# Altium project RFID Access Control System.PrjPcb
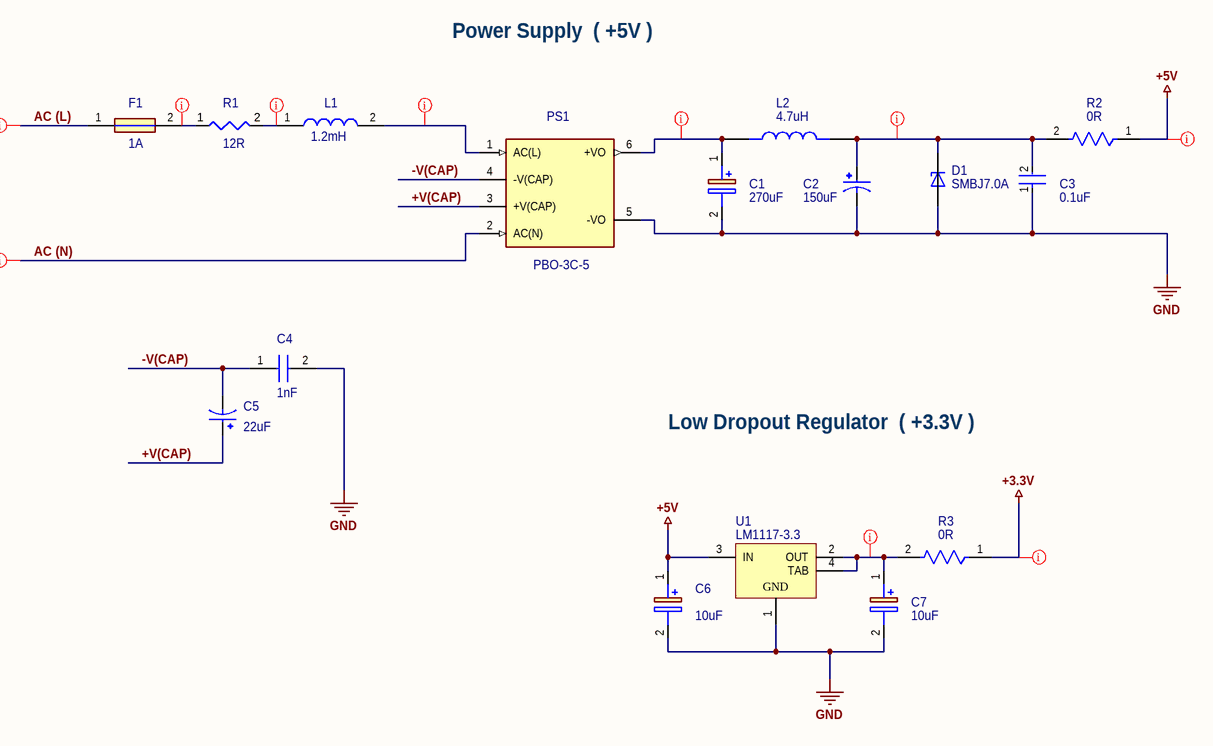
[diagram p0: Power Supply and Regulation.SchDoc]
3 sheets, 43 parts. Net scope: global (net labels, ports and power ports of the same name join across sheets).
Board files: Main.PcbDoc, Main_v2.PcbDoc
Sheets:
  Power Supply and Regulation.SchDoc
  IO and MCU.SchDoc
  External connections.SchDoc

## Sheet Power Supply and Regulation.SchDoc: Power Supply and Regulation Section
size A4; DrawnBy: Avishka C. Herath; DocumentNumber: EN2160 #1; Revision: 1.12; SheetNumber: 1; SheetTotal: 3; Index Number: 200212F; Project: RFID Access Control System

### Parts
C1  270uF  [CAPPRD250W65D630H900]
C2  150uF  [CAPPRD500W60D800H1150]
C3  0.1uF  [FP-CL10-0_1-MFG]
C4  1nF  [B32529C8102J]
C5  22uF  [CAPPRD750W80D1600H2500]
C6  10uF  [T491B]
C7  10uF  [T491B]
D1  SMBJ7.0A  [DIOM4336X265N]
F1  1A  [SS5H1AAPH]
L1  1.2mH  [RLB9012122KL]
L2  4.7uH  [IND_ASPI-0615FS-4R7M-T2]
PS1  PBO-3C-5  [CONV_PBO-3C-5]
R1  12R  [WA84-12RJI-Footprint-1]
R2  0R  [FP-RC0805-MFG]
R3  0R  [FP-RC0805-MFG]
U1  LM1117-3.3  [DCY0004A_L]

### Nets
+3.3V: R3.1
+5V: C6.1(+) R2.1 U1.3(IN)
GND: C1.2(-) C2.N C3.1 C4.2 C6.2(-) C7.2(-) D1.A PS1.5(-VO) U1.1(GND)
+V(CAP): C5.P PS1.3(+V(CAP))
-V(CAP): C4.1 C5.N PS1.4(-V(CAP))
AC (L): F1.1
AC (N): PS1.2(AC(N))
NetC1_1: C1.1(+) L2.1 PS1.6(+VO)
NetC2_P: C2.P C3.2 D1.C L2.2 R2.2
NetC7_1: C7.1(+) R3.2 U1.2(OUT) U1.4(TAB)
NetF1_2: F1.2 R1.1
NetL1_1: L1.1 R1.2
NetL1_2: L1.2 PS1.1(AC(L))

Not connected (* = marked no-connect by the designer): PS1 4_2(-V(CAP)) 5_2(-VO)

### Layout directives
net class V_out: +3.3V, +5V, NetC1_1, NetC2_P, NetC7_1
net class AC: AC (L), AC (N), NetF1_2, NetL1_1, NetL1_2

### Notes on the sheet
- Power Supply  ( +5V )
- Low Dropout Regulator  ( +3.3V )
- Title:
- Size:
- Date:
- A4
- Document Number:
- Sheet
- Revision:
- of
- Project:
- Drawn By:

### Library data of the parts
C1 = 6SEPC560MW+TSS: Aluminum Organic Polymer Capacitors; Manufacturer_Name: KEMET; Manufacturer_Part_Number: A750EM277M1CAAE015; Datasheet Link: http://industrial.panasonic.com/cdbs/www-data/pdf/AAB8000/AAB8000C247.pdf; Height: 9mm; Mouser Part Number: 667-6SEPC560MW+TSS; Mouser Price/Stock: https://www.mouser.co.uk/ProductDetail/Panasonic/6SEPC560MW%2bTSS?qs=OE1iw1LrrPGkg%2Fufb0Bk8Q%3D%3D; Arrow Part Number: 6SEPC560MW+TSS; Arrow Price/Stock: https://www.arrow.com/en/products/6sepc560mwtss/panasonic?region=nac
C2 = EEUFR1V221B: FR-A; MF: {'manufacturer': u'Panasonic'}; MP: UHE1V151MPD1TD; Value: *; Price: None; Availability: Unavailable; Package: None
C3 = CMP-13271-000011-1: CAP CER 0.1UF 50V X7R 0603; Manufacturer: Samsung Electro-Mechanics America, Inc; Manufacturer Part Number: CL10B104JB8NNNC; Value: 100nF; Material: Ceramic; Temperature Coefficient: 15%; Tolerance: 5%; Ipc Land Pattern Name: CAPC16080X80; Device Class L1: Passive Components; Digikey Description: CAP CER 0.1UF 50V X7R 0603; Voltage Rating: 50V; Height: 0.9mm; ComponentLink2Description: Datasheet; Device Class L2: Capacitors; ComponentLink2URL: http://www.samsungsem.com/kr/support/product-search/mlcc/__icsFiles/afieldfile/2019/06/18/CL10B104JB8NNNC-19.pdf; Temperature Characteristic: X7R; Temperature Range High: +125°C; Lead Free: Yes; Temperature Range Low: -55°C; Category: Cap; Package: CL10-0.1; Temperature: -55°C to +125°C; Octopart: https://octopart.com/cl10b104jb8nnnc-samsung-9302151; Device Class L3: Ceramic Capacitors; RoHS: TRUE; Automotive: No; Capacitance: 100nF
C4 = B32529C8102J: Capacitor; Manufacturer_Name: TDK; Datasheet Link: https://componentsearchengine.com/Datasheets/1/B32529C8102J.pdf; Height: 6.5mm; Manufacturer_Part_Number: B32529C8102J; Mouser Part Number: 871-B32529C8102J; Mouser Price/Stock: https://www.mouser.co.uk/ProductDetail/EPCOS-TDK/B32529C8102J?qs=CveI%2FUwZDBKgVtfngCVMDw%3D%3D
C5 = EEUTP1E272B: Aluminum Electrolytic Capacitors - Radial Leaded; MF: Nichicon; MP: UVR2W220MHD; Value: 22uF; Price: None; Availability: Unavailable; Package: Bulk; ComponentLink1Description: Mouser; ComponentLink1URL: https://www.mouser.com/ProductDetail/Nichicon/UVR2W220MHD?qs=%252BlpsHQzXjw%2F%252B5drQqN1W8w%3D%3D; Supplier 1: Rs; Supplier Part Number 1: 5201365
C6 C7 = T491B106M010AT: Capacitor Polarised; Manufacturer_Name: KEMET; Datasheet Link: https://content.kemet.com/datasheets/KEM_T2005_T491.pdf; Height: 2.1mm; Manufacturer_Part_Number: T491B106M010AT; Mouser Part Number: 80-T491B106M010; Arrow Part Number: T491B106M010AT; Arrow Price/Stock: https://www.arrow.com/en/products/t491b106m010at/kemet-corporation?region=nac
D1 = SMBJ7.0A: MF: {'manufacturer': u'Littelfuse'}; Value: *; Price: None; Availability: Unavailable; Package: None; MP: SMBJ7.0A
F1 = CMP-018-000000-1: Fuse; Manufacturer_Name: Eaton; Datasheet Link: https://www.eaton.com/content/dam/eaton/products/electronic-components/resources/data-sheet/eaton-ss-5h-subminiature-radial-leaded-time-delay-fuses-data-sheet.pdf; Height: 8.55mm; Arrow Price/Stock: https://www.arrow.com/en/products/ss-5h-1a-aph/eaton?region=nac; Pin Count: 2; Source: SamacSys.SchLib; Design Item ID: SS-5H-1A-APH; Mouser Part Number: 504-SS-5H-1A-APH; Manufacturer_Part_Number: SS-5H-1A-APH; Arrow Part Number: SS-5H-1A-APH; Component Type: Standard; Mouser Price/Stock: https://www.mouser.co.uk/ProductDetail/Bussmann-Eaton/SS-5H-1A-APH?qs=uEhifBLpbD3ldHjMqFUUYA%3D%3D
L1 = RLB9012-122KL: Inductor; Manufacturer_Name: Bourns; Datasheet Link: https://datasheet.datasheetarchive.com/originals/dk/DKDS-12/225018.pdf; Height: 12.2mm; Manufacturer_Part_Number: RLB9012-122KL; Mouser Part Number: 652-RLB9012-122KL; Mouser Price/Stock: https://www.mouser.co.uk/ProductDetail/Bourns/RLB9012-122KL?qs=dB0LedT%252BmmC%2Fvhpfl8NA4g%3D%3D; Arrow Part Number: RLB9012-122KL; Arrow Price/Stock: https://www.arrow.com/en/products/rlb9012-122kl/bourns?region=nac
L2 = ASPI-0615FS-4R7M-T2: MF: {'manufacturer': u'Abracon'}; Value: *; Price: None; Availability: Unavailable; Package: None; MP: ASPI-0615FS-4R7M-T2
PS1 = PBO-3C-5: MF: {'manufacturer': u'CUI'}; Value: *; Price: None; Availability: Unavailable; Package: None; MP: PBO-3C-5
R1 = CMP-009-00177-4: Through Hole Wirewound Resistor, Wa80 Series, 12 Ohm, 3 W, - 5%, 100 V, Axial Leaded Rohs Compliant: Yes; Body Length: 14.5mm; Lead Length: 24.55mm; Lead Diameter: 0.8mm; Body Diameter: 5.2mm; Case/Package: Axial
R2 R3 = CMP-2001-04570-2: RES SMD 0 OHM JUMPER 1/8W 0805; Manufacturer: Yageo; Manufacturer Part Number: RC0805FR-070RL; Resistance: 0Ω; Value: 0Ω; Power Rating: 0.125W; Tolerance: 1%; Voltage Rating: 150V; RoHS: TRUE; Device Class L2: Resistors; Composition: Thick Film; Device Class L1: Passive Components; Height: 0.6mm; Category: Res; Automotive: No; Device Class L3: Chip SMD Resistors; ComponentLink2URL: http://www.yageo.com/documents/recent/PYu-RC_Group_51_RoHS_L_10.pdf; Octopart: https://octopart.com/rc0805fr-070rl-yageo-9293404; Temperature Range High: +155°C; Ipc Land Pattern Name: RESC200125X50; Footprint Url: http://www.yageo.com/exep/pages/download/literatures/PYu-R_Mount_10.pdf; Series: RC_L; Digikey Description: RES SMD 0 OHM JUMPER 1/8W 0805; Temperature Range Low: -55°C; Temperature: -55°C to +155°C; Package: RC0805; ComponentLink2Description: Datasheet; Lead Free: Yes
U1 = CMP-0062-01639-4: 800mA Low-Dropout Linear Regulator, 4-pin SOT-223, Pb-Free; PartNumber: LM1117MPX-3.3/NOPB; Manufacturer: Texas Instruments; High-Reliability: Y; PowerWise: N; PackageTopMarking: XYTT*N05A; CompType: LDO IC; ComponentLink1URL: http://www.ti.com/general/docs/lit/getliterature.tsp?genericPartNumber=LM1117-N&fileType=pdf; ComponentLink1Description: Datasheet URL; PinCount: 4; Code_JEDEC: TO-261-AA; PackageDescription: Molded SOT-223, 6.50 x 3.56 x 1.6mm Body, 4 Lead, 2.3mm Pitch; PackageReference: DCY0004A; RoHS: Y; Code_IPC: SOT223-4

## Sheet IO and MCU.SchDoc: IO and MCU Section
size A4; DrawnBy: Avishka C. Herath; DocumentNumber: EN2160 #2; Revision: 1.12; SheetNumber: 2; SheetTotal: 3; Index Number: 200212F; Project: RFID Access Control System; ENG_APP_DATE: --/--/--; DSN_APP_DATE: --/--/--; CHK_APP_DATE: --/--/--
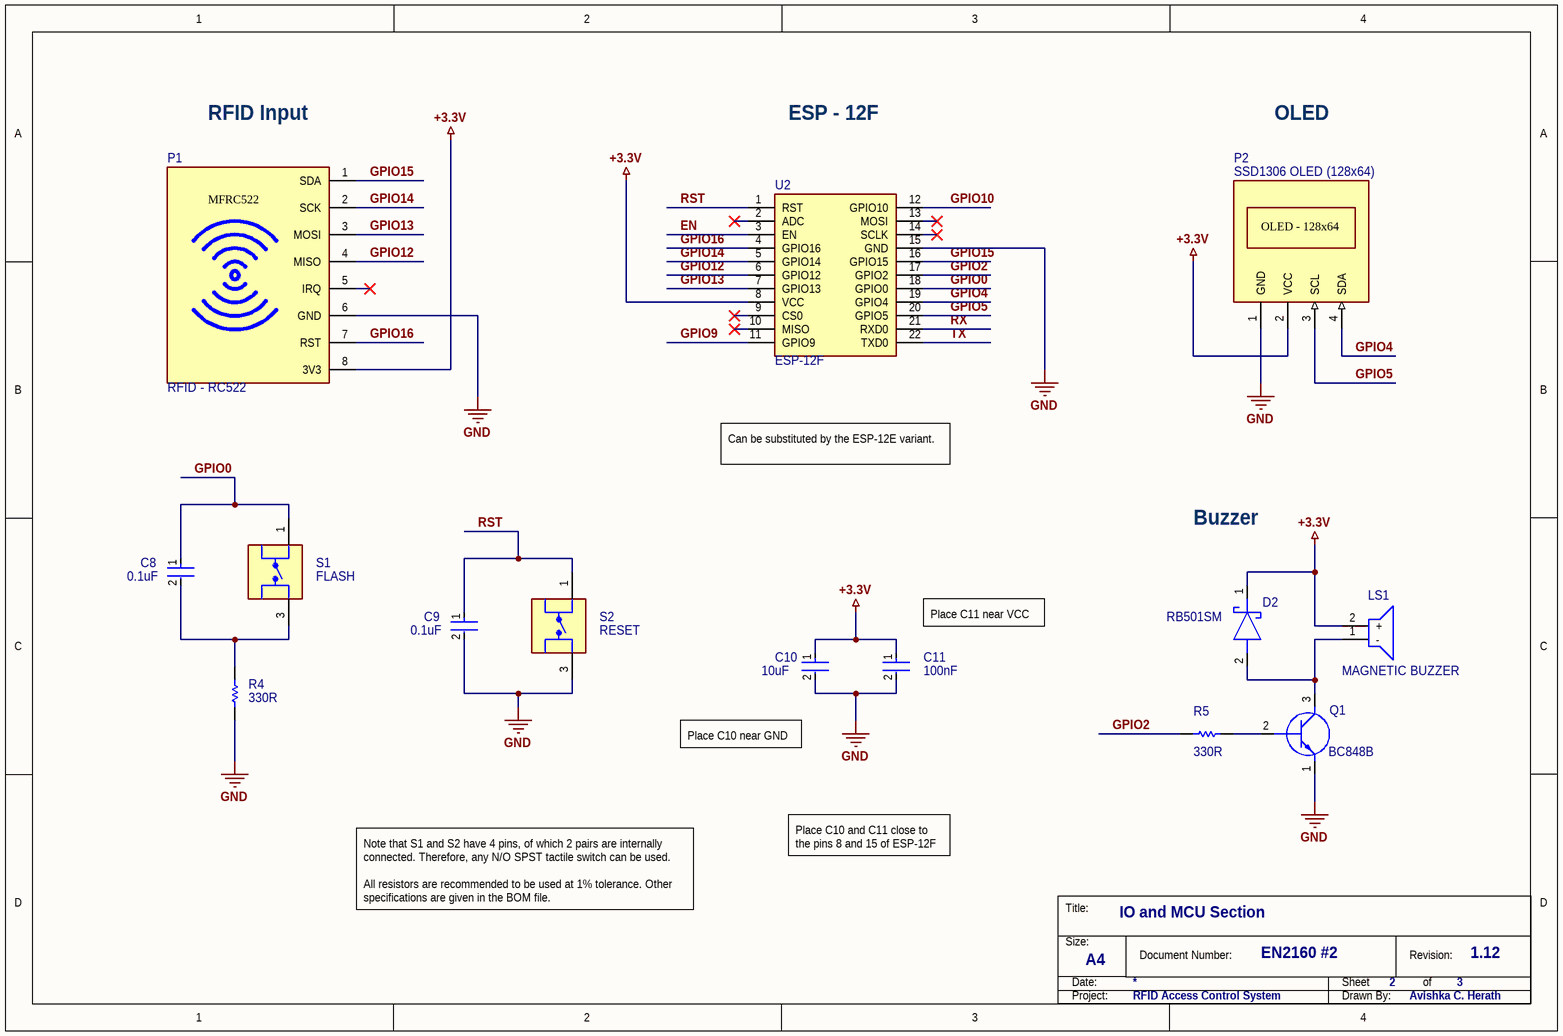
[diagram p1: IO and MCU.SchDoc]

### Parts
C8  0.1uF  [FP-CL10-0_1-MFG]
C9  0.1uF  [FP-CL10-0_1-MFG]
C10  10uF  [FP-CL21-IPC_B]
C11  100nF  [FP-CL10-0_1-MFG]
D2  RB501SM  [RB501SM30FHT2R]
LS1  MAGNETIC BUZZER  [CMI1295IC0385T]
P1  RFID - RC522  [RFID - RC522-Footprint-1]
P2  SSD1306 OLED (128x64)  [SSD1306 OLED (128x64)-Footprint-1]
Q1  BC848B  [SOT95P240X120-3N]
R4  330R  [RESC2013X60X35ML10T20]
R5  330R  [RESC2013X60X35ML10T20]
S1  FLASH  [SW_PTS525SM15SMTR2LFS]
S2  RESET  [SW_PTS525SM15SMTR2LFS]
U2  ESP-12F  [esp12f]

### Nets
+3.3V: C10.1 C11.1 D2.1(K) LS1.2(+) P1.8(3V3) P2.2(VCC) U2.8(VCC)
GND: C9.2 C10.2 C11.2 P1.6(GND) P2.1(GND) Q1.1(E) R4.2 S2.3 U2.15(GND)
EN: U2.3(EN)
GPIO0: C8.1 S1.1 U2.18(GPIO0)
GPIO2: R5.1 U2.17(GPIO2)
GPIO4: P2.4(SDA) U2.19(GPIO4)
GPIO5: P2.3(SCL) U2.20(GPIO5)
GPIO9: U2.11(GPIO9)
GPIO10: U2.12(GPIO10)
GPIO12: P1.4(MISO) U2.6(GPIO12)
GPIO13: P1.3(MOSI) U2.7(GPIO13)
GPIO14: P1.2(SCK) U2.5(GPIO14)
GPIO15: P1.1(SDA) U2.16(GPIO15)
GPIO16: P1.7(RST) U2.4(GPIO16)
RST: C9.1 S2.1 U2.1(RST)
RX: U2.21(RXD0)
TX: U2.22(TXD0)
NetC8_2: C8.2 R4.1 S1.3
NetD2_2: D2.2(A) LS1.1(-) Q1.3(C)
NetQ1_2: Q1.2(B) R5.2

Not connected (* = marked no-connect by the designer): P1 5(IRQ)*; S1 2 4; S2 2 4; U2 2(ADC)* 9(CS0)* 10(MISO)* 13(MOSI)* 14(SCLK)*

### Notes on the sheet
- RFID Input
- ESP - 12F
- OLED
- Can be substituted by the ESP-12E variant.
- Buzzer
- (near C11) Place C11 near VCC
- (near C10) Place C10 near GND
- Place C10 and C11 close to the pins 8 and 15 of ESP-12F in PCB.
- Note that S1 and S2 have 4 pins, of which 2 pairs are internally connected. Therefore, any N/O SPST tactile switch can be used.
  All resistors are recommended to be used at 1% tolerance. Other specifications are given in the BOM file.
- Title:
- Size:
- Date:
- A4
- Document Number:
- Sheet
- Revision:
- of
- Project:
- Drawn By:
- (in symbol CMP-00026-00001-2) OLED - 128x64

### Library data of the parts
C8 C9 = CMP-13271-000011-1: as C3 on sheet Power Supply and Regulation; Ipc Land Pattern Name: CAPC16080X80; Device Class L1: Passive Components; Digikey Description: CAP CER 0.1UF 50V X7R 0603; Voltage Rating: 50V; Height: 0.9mm; ComponentLink2Description: Datasheet; Device Class L2: Capacitors; ComponentLink2URL: http://www.samsungsem.com/kr/support/product-search/mlcc/__icsFiles/afieldfile/2019/06/18/CL10B104JB8NNNC-19.pdf; Temperature Characteristic: X7R; Temperature Range High: +125°C; Lead Free: Yes; Temperature Range Low: -55°C; Category: Cap; Package: CL10-0.1; Temperature: -55°C to +125°C; Octopart: https://octopart.com/cl10b104jb8nnnc-samsung-9302151; Device Class L3: Ceramic Capacitors; RoHS: TRUE; Automotive: No; Capacitance: 100nF
C10 = CMP-2000-06102-2: CL21 Series 0805 10uF 16V ±10% Tolerance X5R Multilayer Ceramic Chip Capacitor; Dielectric: X7R; Length: 2mm; Depth: 1.25mm; Voltage: 16V; Width: 0.049inch; Capacitance: 10uF; Lead Free: Lead Free; Max Operating Temperature: 85°C; Mount: Surface Mount; Voltage Rating: 16V; Height: 1.25mm; Radiation Hardening: No; Packaging: Tape and Reel; Voltage Rating (DC): 16V; Thickness: 0.055inch; Case/Package: 0805; Case Code (Imperial): 0805; Min Operating Temperature: -55°C; Case Code (Metric): 2012; Package Quantity: 1; Tolerance: 10%
C11 = CMP-13271-000011-1: CAP CER 0.1UF 50V X7R 0603; Manufacturer: Samsung Electro-Mechanics America, Inc; Manufacturer Part Number: CL10B104JB8NNNC; Material: Ceramic; Temperature Coefficient: 15%; Tolerance: 5%; Ipc Land Pattern Name: CAPC16080X80; Device Class L1: Passive Components; Digikey Description: CAP CER 0.1UF 50V X7R 0603; Voltage Rating: 50V; Height: 0.9mm; ComponentLink2Description: Datasheet; Device Class L2: Capacitors; ComponentLink2URL: http://www.samsungsem.com/kr/support/product-search/mlcc/__icsFiles/afieldfile/2019/06/18/CL10B104JB8NNNC-19.pdf; Temperature Characteristic: X7R; Value: 100nF; Temperature Range High: +125°C; Lead Free: Yes; Temperature Range Low: -55°C; Category: Cap; Package: CL10-0.1; Temperature: -55°C to +125°C; Octopart: https://octopart.com/cl10b104jb8nnnc-samsung-9302151; Device Class L3: Ceramic Capacitors; RoHS: TRUE; Automotive: No; Capacitance: 100nF
D2 = RB501SM-30FHT2R: Schottky Diode; Manufacturer_Name: ROHM Semiconductor; Datasheet Link: https://fscdn.rohm.com/en/products/databook/datasheet/discrete/diode/schottky_barrier/rb501sm-30fht2r-e.pdf; Height: 0.6mm; Manufacturer_Part_Number: RB501SM-30FHT2R; Mouser Part Number: 755-RB501SM-30FHT2R; Mouser Price/Stock: https://www.mouser.co.uk/ProductDetail/ROHM-Semiconductor/RB501SM-30FHT2R?qs=4v%252BiZTmLVHEIefGC27iswg%3D%3D
LS1 = CMI-1295IC-0385T: Loudspeaker or Buzzer; Manufacturer_Name: CUI Devices; Datasheet Link: https://www.arrow.com/en/products/cmi-1295ic-0385t/cui-devices; Height: 9.7mm; Manufacturer_Part_Number: CMI-1295IC-0385T; Mouser Part Number: 490-CMI-1295IC-0385T; Mouser Price/Stock: https://www.mouser.co.uk/ProductDetail/CUI-Devices/CMI-1295IC-0385T?qs=OlC7AqGiEDk2g42uzfEhlg%3D%3D; Arrow Part Number: CMI-1295IC-0385T; Arrow Price/Stock: https://www.arrow.com/en/products/cmi-1295ic-0385t/cui-devices?region=nac
P1 = CMP-00025-00003-1: A 13.56MHz RF reader module, which use the RC522 IC, plus 2 S50 RFID cards to help you learn and add the 13.56 MHz RF transition to your project.; IC: MFRC522; Interface: I2C,SPI,UART; Operating Frequency: 13.56 MHz; Dimensions: 40mm×60mm
P2 = CMP-00026-00001-2: The OLED display module is a small 0.96" diagonal display made of individual blue OLED pixels that can be turned on or off by the controller chip. It does not require a backlight and is compatible with I2C communication through the SSD1306 driver chip.; Number of Pixels: 128 × 64; Size: 0.96"; Interface: I2C; Dimension: 27.8 x27.3x 4.3 mm
Q1 = BC848BHZGT116: Transistor BJT NPN; Manufacturer_Name: ROHM Semiconductor; Datasheet Link: https://componentsearchengine.com/Datasheets/2/BC848BHZGT116.pdf; Height: 1.2mm; Manufacturer_Part_Number: BC848BHZGT116; Mouser Part Number: 755-BC848BHZGT116; Mouser Price/Stock: https://www.mouser.co.uk/ProductDetail/ROHM-Semiconductor/BC848BHZGT116?qs=zGux8KhMp6JnZZvroKxywg%3D%3D
R4 R5 = CMP-009-00179-1: Res Thick Film 0805 330R Ohm 1% 0.125W(1/8W) +/-100ppm/C Epoxy Pad SMD T/R
S1 S2 = CMP-035-000000-1: Tactile Switch SPST-NO Top Actuated Surface Mount; MP: PTS525SM15SMTR2 LFS; MF: C&K; Purchase-URL: https://pricing.snapeda.com/search/part/PTS525SM15SMTR2 LFS/?ref=eda; Value: *; Component Type: Standard; Check_prices: https://www.snapeda.com/parts/PTS525SM15SMTR2%20LFS/C%2526K/view-part/?ref=eda; SnapEDA_Link: https://www.snapeda.com/parts/PTS525SM15SMTR2%20LFS/C%2526K/view-part/?ref=snap; Design Item ID: PTS525SM15SMTR2LFS; Pin Count: 4; Source: PTS525SM15SMTR2LFS.SchLib; Price: None; Availability: In Stock; Package: Tactile Switch CK
U2 = ESP-12F: Integrated Circuit; Manufacturer_Name: Ai-Thinker; Datasheet Link: https://docs.ai-thinker.com/_media/esp8266/docs/esp-12f_product_specification_en.pdf; Height: 3.1mm; Manufacturer_Part_Number: ESP-12F

## Sheet External connections.SchDoc: External Connections Section
size A4; DrawnBy: Avishka C. Herath; DocumentNumber: EN2160 #3; Revision: 1.12; SheetNumber: 3; SheetTotal: 3; Project: RFID Access Control System
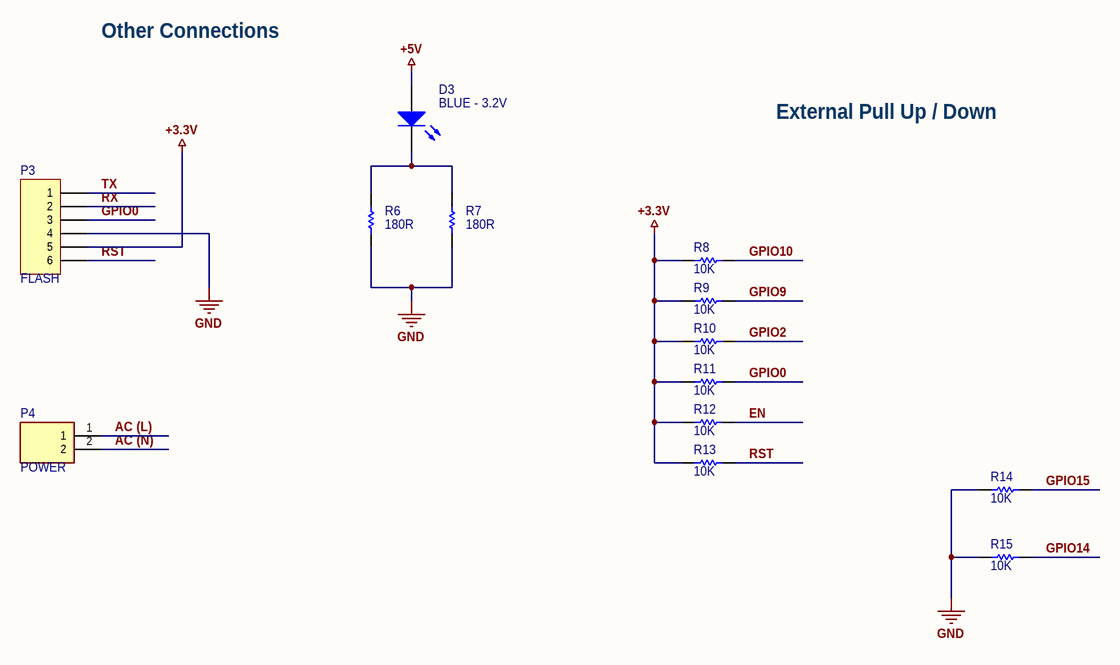
[diagram p2: External connections.SchDoc]

### Parts
D3  BLUE - 3.2V  [3528]
P3  FLASH  [My_1X06]
P4  POWER  [TB00250002BE]
R6  180R  [RESC2013X60X35ML10T20]
R7  180R  [RESC2013X60X35ML10T20]
R8  10K  [RESC2013X60X35ML10T20]
R9  10K  [RESC2013X60X35ML10T20]
R10  10K  [RESC2013X60X35ML10T20]
R11  10K  [RESC2013X60X35ML10T20]
R12  10K  [RESC2013X60X35ML10T20]
R13  10K  [RESC2013X60X35ML10T20]
R14  10K  [RESC2013X60X35ML10T20]
R15  10K  [RESC2013X60X35ML10T20]

### Nets
+3.3V: P3.5 R8.2 R9.2 R10.2 R11.2 R12.1 R13.1
+5V: D3.2(A)
GND: P3.4 R6.2 R7.2 R14.2 R15.2
AC (L): P4.1
AC (N): P4.2
EN: R12.2
GPIO0: P3.3 R11.1
GPIO2: R10.1
GPIO9: R9.1
GPIO10: R8.1
GPIO14: R15.1
GPIO15: R14.1
RST: P3.6 R13.2
RX: P3.2
TX: P3.1
NetD3_1: D3.1(K) R6.1 R7.1

### Notes on the sheet
- Other Connections
- External Pull Up / Down
- Title:
- Size:
- Date:
- A4
- Document Number:
- Sheet
- Revision:
- of
- Project:
- Drawn By:

### Library data of the parts
D3 = CMP-1429-00005-1: SMD mono-color Top LED, WL-SMTW, Blue; PartNumber: 150141BS73100; Manufacturer: Wuerth Elektronik; ComponentLink2Description: Datasheet; ComponentLink1Description: Manufacturer URL; ComponentLink2URL: http://katalog.we-online.com/led/datasheet/150141BS73100.pdf; ComponentLink1URL: http://www.we-online.com; PackageReference: 3528; Color: Blue
P3 = Header 6: Header, 6-Pin; ASiD Part Number: Header 6-AS
P4 = TB002-500-02BE: Connector; Manufacturer_Name: CUI Devices; Datasheet Link: https://eu.mouser.com/datasheet/2/670/tb002_500-1550579.pdf; Height: 10.4mm; Manufacturer_Part_Number: TB002-500-02BE; Mouser Part Number: 490-TB002-500-02BE; Mouser Price/Stock: https://www.mouser.co.uk/ProductDetail/CUI-Devices/TB002-500-02BE?qs=vLWxofP3U2x9716kcgva%2Fw%3D%3D; Arrow Part Number: TB002-500-02BE; Arrow Price/Stock: https://www.arrow.com/en/products/tb002-500-02be/cui-devices?region=nac
R6 R7 = CMP-009-00179-1: Res Thick Film 0805 180R Ohm 1% 0.125W(1/8W) +/-100ppm/C Epoxy Pad SMD T/R
R8-R15 = CMP-009-00179-1: Res Thick Film 0805 10K Ohm 1% 0.125W(1/8W) +/-100ppm/C Epoxy Pad SMD T/R

## Nets that join several sheets
+3.3V: Power Supply and Regulation (R3.1), IO and MCU (7 pins), External connections (7 pins)
+5V: Power Supply and Regulation (C6.1 R2.1 U1.3), External connections (D3.2)
GND: Power Supply and Regulation (9 pins), IO and MCU (9 pins), External connections (5 pins)
AC (L): Power Supply and Regulation (F1.1), External connections (P4.1)
AC (N): Power Supply and Regulation (PS1.2), External connections (P4.2)
EN: IO and MCU (U2.3), External connections (R12.2)
GPIO0: IO and MCU (C8.1 S1.1 U2.18), External connections (P3.3 R11.1)
GPIO2: IO and MCU (R5.1 U2.17), External connections (R10.1)
GPIO9: IO and MCU (U2.11), External connections (R9.1)
GPIO10: IO and MCU (U2.12), External connections (R8.1)
GPIO14: IO and MCU (P1.2 U2.5), External connections (R15.1)
GPIO15: IO and MCU (P1.1 U2.16), External connections (R14.1)
RST: IO and MCU (C9.1 S2.1 U2.1), External connections (P3.6 R13.2)
RX: IO and MCU (U2.21), External connections (P3.2)
TX: IO and MCU (U2.22), External connections (P3.1)